# Altium schematic sheet ICs.SchDoc
size A4; DocumentNumber: 2; SheetNumber: 2; SheetTotal: 6
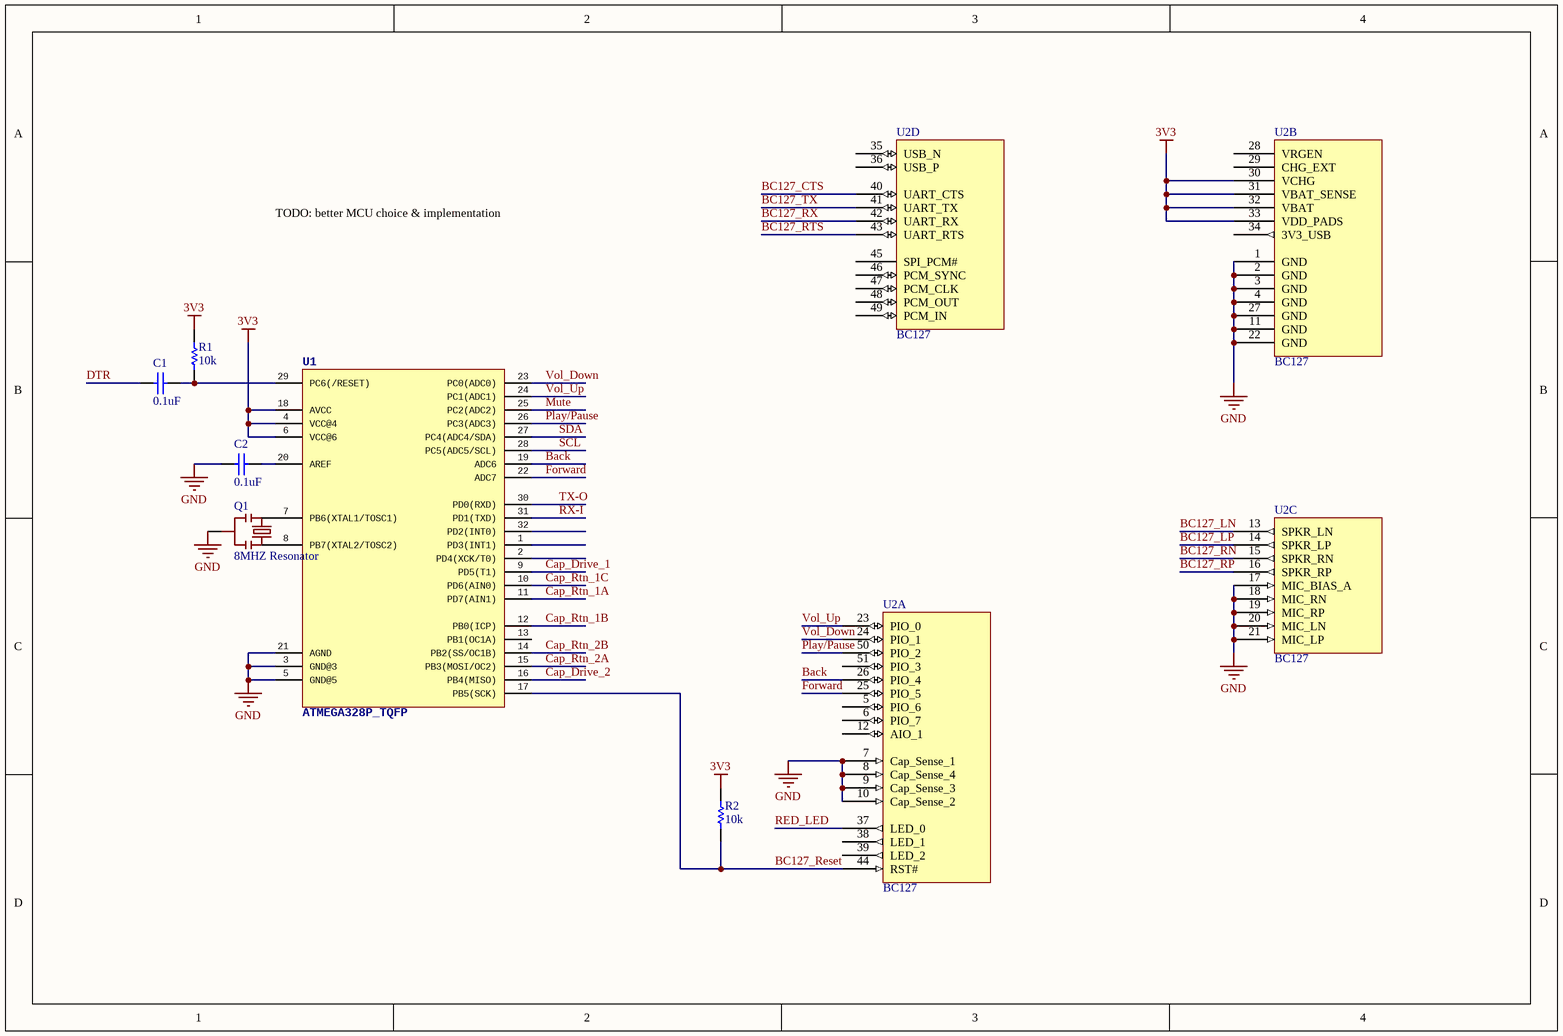
[diagram p0: ICs.SchDoc]

## Parts
C1  0.1uF  [CAPC1608X09N]
C2  0.1uF  [CAPC1608X09N]
Q1  8MHZ Resonator  [MURATA CSTCE8M00G52Z-R0]
R1  10k  [RESC1608X06N]
R2  10k  [RESC1608X06N]
U1  ATMEGA328P_TQFP  [TQFP32-08]
U2  BC127  [BC127 - No Keepout]  (parts A,B,C,D of 4)

## Nets
3V3: R1.2 R2.2 U1.4(VCC@4) U1.6(VCC@6) U1.18(AVCC) U2.30(VCHG) U2.31(VBAT_SENSE) U2.32(VBAT) U2.33(VDD_PADS)
GND: C2.1 Q1.2(GND) U1.3(GND@3) U1.5(GND@5) U1.21(AGND) U2.1(GND) U2.2(GND) U2.3(GND) U2.4(GND) U2.7(Cap_Sense_1) U2.8(Cap_Sense_4) U2.9(Cap_Sense_3) U2.10(Cap_Sense_2) U2.11(GND) U2.17(MIC_BIAS_A) U2.18(MIC_RN) U2.19(MIC_RP) U2.20(MIC_LN) U2.21(MIC_LP) U2.22(GND) U2.27(GND)
Back: U1.19(ADC6) U2.26(PIO_4)
BC127_CTS: U2.40(UART_CTS)
BC127_LN: U2.13(SPKR_LN)
BC127_LP: U2.14(SPKR_LP)
BC127_Reset: R2.1 U1.17(PB5(SCK)) U2.44(RST#)
BC127_RN: U2.15(SPKR_RN)
BC127_RP: U2.16(SPKR_RP)
BC127_RTS: U2.43(UART_RTS)
BC127_RX: U2.42(UART_RX)
BC127_TX: U2.41(UART_TX)
Cap_Drive_1: U1.9(PD5(T1))
Cap_Drive_2: U1.16(PB4(MISO))
Cap_Rtn_1A: U1.11(PD7(AIN1))
Cap_Rtn_1B: U1.12(PB0(ICP))
Cap_Rtn_1C: U1.10(PD6(AIN0))
Cap_Rtn_2A: U1.15(PB3(MOSI/OC2))
Cap_Rtn_2B: U1.14(PB2(SS/OC1B))
DTR: C1.1
Forward: U1.22(ADC7) U2.25(PIO_5)
Mute: U1.25(PC2(ADC2))
Play/Pause: U1.26(PC3(ADC3)) U2.50(PIO_2)
RED_LED: U2.37(LED_0)
RX-I: U1.31(PD1(TXD))
SCL: U1.28(PC5(ADC5/SCL))
SDA: U1.27(PC4(ADC4/SDA))
TX-O: U1.30(PD0(RXD))
Vol_Down: U1.23(PC0(ADC0)) U2.24(PIO_1)
Vol_Up: U1.24(PC1(ADC1)) U2.23(PIO_0)
NetC1_2: C1.2 R1.1 U1.29(PC6(/RESET))
NetC2_2: C2.2 U1.20(AREF)
NetQ1_1: Q1.1 U1.7(PB6(XTAL1/TOSC1))
NetQ1_3: Q1.3 U1.8(PB7(XTAL2/TOSC2))

Not connected (* = marked no-connect by the designer): U1 1(PD3(INT1)) 2(PD4(XCK/T0)) 13(PB1(OC1A)) 32(PD2(INT0)); U2 5(PIO_6) 6(PIO_7) 12(AIO_1) 28(VRGEN) 29(CHG_EXT) 34(3V3_USB) 35(USB_N) 36(USB_P) 38(LED_1) 39(LED_2) 45(SPI_PCM#) 46(PCM_SYNC) 47(PCM_CLK) 48(PCM_OUT) 49(PCM_IN) 51(PIO_3)

## Notes on the sheet
- TODO: better MCU choice & implementation

## Library data of the parts
C1 C2 = CAP CER 0.1uF 0603: Voltage: 100V; Rating: X7R; Tolerance: 10%; Value: 0.1uF; Digikey Part Number: 490-3285-1-ND; Package: 0603
Q1 = RESONATOR 8MHZ: Digikey Part Number: 490-5995-1-ND
R1 R2 = RES 10K 0603: Manufacturer: Yageo; Manufacturer Part Number: RC0603FR-0710KL; Tolerance: 1%; Power: 0.1W; Type: RES; Footprint: 0603; Temperature: 155dC; Digikey Part Number: 311-10.0KHRCT-ND; Value: 10k
U1 = ATMEGA328P_TQFP: PROD_ID: IC-09069; Digikey Part Number: ATMEGA328P-AURCT-ND